# Altium schematic sheet BMS Carrier - AFE Interface.SchDoc: Interfaces
size Tabloid; Author: Liam Sky, Annika Logarta; Revision: 1.0; SheetNumber: 2; SheetTotal: 4; Website: www.uwmidsun.com
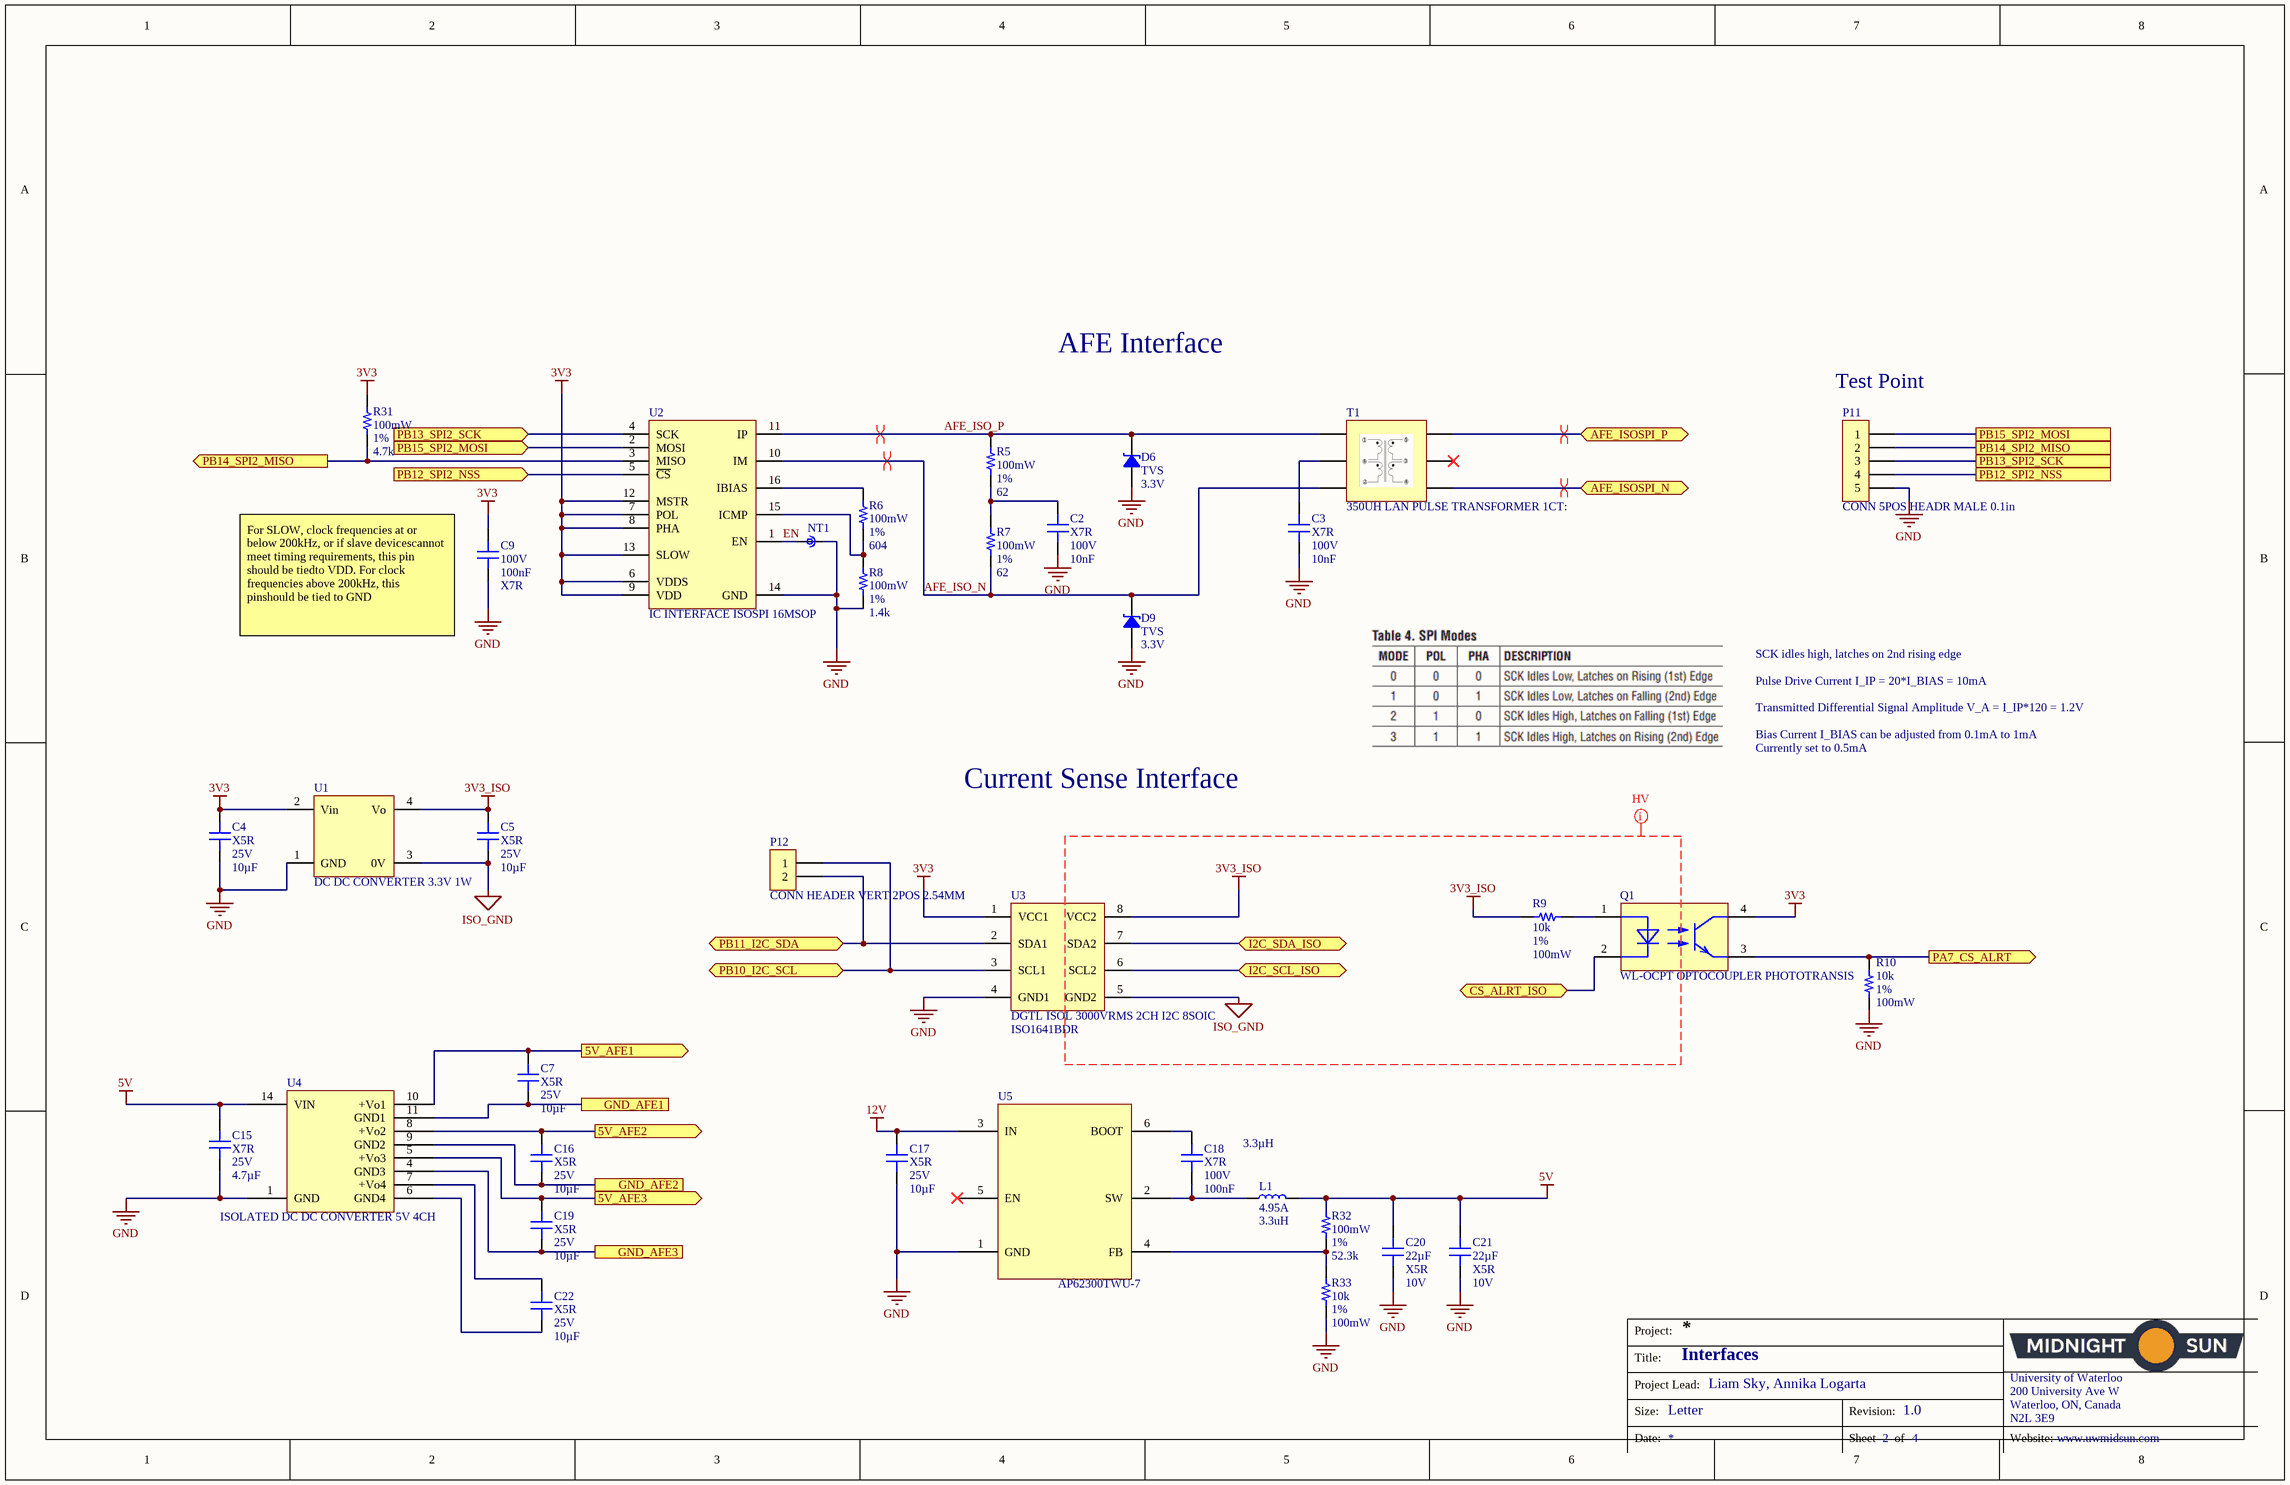
[diagram p0: BMS Carrier - AFE Interface.SchDoc]

## Parts
C2  Dielectric Code: X7R  Voltage Rating: 100V  Capacitance: 10nF  [CAP 0603_1608]  (hidden comment: CAP CER 10NF 100V 10% X7R 0603)
C3  Dielectric Code: X7R  Voltage Rating: 100V  Capacitance: 10nF  [CAP 0603_1608]  (hidden comment: CAP CER 10NF 100V 10% X7R 0603)
C4  Dielectric Code: X5R  Voltage Rating: 25V  Capacitance: 10µF  [CAP 0603_1608]  (hidden comment: CAP CER 10UF 25V 20% X5R 0603)
C5  Dielectric Code: X5R  Voltage Rating: 25V  Capacitance: 10µF  [CAP 0603_1608]  (hidden comment: CAP CER 10UF 25V 20% X5R 0603)
C7  Dielectric Code: X5R  Voltage Rating: 25V  Capacitance: 10µF  [CAP 0603_1608]  (hidden comment: CAP CER 10UF 25V 20% X5R 0603)
C9  Voltage Rating: 100V  Capacitance: 100nF  Dielectric Code: X7R  [CAP 0603_1608]  (hidden comment: CAP CER 0.1UF 100V 10% X7R 0603)
C15  Dielectric Code: X7R  Voltage Rating: 25V  Capacitance: 4.7µF  [CAP 0603_1608]  (hidden comment: CAP CER 4.7UF 25V 10% X5R 0603)
C16  Dielectric Code: X5R  Voltage Rating: 25V  Capacitance: 10µF  [CAP 0603_1608]  (hidden comment: CAP CER 10UF 25V 20% X5R 0603)
C17  Dielectric Code: X5R  Voltage Rating: 25V  Capacitance: 10µF  [CAP 0603_1608]  (hidden comment: CAP CER 10UF 25V 20% X5R 0603)
C18  Dielectric Code: X7R  Voltage Rating: 100V  Capacitance: 100nF  [CAP 0603_1608]  (hidden comment: CAP CER 0.1UF 100V 10% X7R 0603)
C19  Dielectric Code: X5R  Voltage Rating: 25V  Capacitance: 10µF  [CAP 0603_1608]  (hidden comment: CAP CER 10UF 25V 20% X5R 0603)
C20  Capacitance: 22µF  Dielectric Code: X5R  Voltage Rating: 10V  [CAP 0603_1608]  (hidden comment: CAP CER 22UF 10V 20% X5R 0603)
C21  Capacitance: 22µF  Dielectric Code: X5R  Voltage Rating: 10V  [CAP 0603_1608]  (hidden comment: CAP CER 22UF 10V 20% X5R 0603)
C22  Dielectric Code: X5R  Voltage Rating: 25V  Capacitance: 10µF  [CAP 0603_1608]  (hidden comment: CAP CER 10UF 25V 20% X5R 0603)
D6  Type: TVS  Reverse Blocking Voltage: 3.3V  [SOD 323]  (hidden comment: TVS DIODE 3.3VWM 10VC SOD323)
D9  Type: TVS  Reverse Blocking Voltage: 3.3V  [SOD 323]  (hidden comment: TVS DIODE 3.3VWM 10VC SOD323)
L1  value 3.3µH  Rated Current-Max: 4.95A  Inductance-Nom (L): 3.3uH  [INDUCTOR TDK 6x6]  (hidden comment: FIXED IND 3.3UH 4.95A 30MOHM SMD)
NT1  Net Tie 5mil  [Net Tie]  (value not drawn)  (net tie, no BOM)
P11  CONN 5POS HEADR MALE 0.1in  [CONN, 5POS HEADR 0.1"]
P12  CONN HEADER VERT 2POS 2.54MM  [HDR1X2]  (no BOM)
Q1  WL-OCPT OPTOCOUPLER PHOTOTRANSIS  [WL-OCPT_LSOP4]
R5  Power Rating: 100mW  Tolerance: 1%  Resistance: 62  [RES 0603_1608]  (hidden comment: RES 62 OHM 1% 1/10W 0603)
R6  Power Rating: 100mW  Tolerance: 1%  Resistance: 604  [RES 0603_1608]  (hidden comment: RES 604 OHM 1% 1/10W 0603)
R7  Power Rating: 100mW  Tolerance: 1%  Resistance: 62  [RES 0603_1608]  (hidden comment: RES 62 OHM 1% 1/10W 0603)
R8  Power Rating: 100mW  Tolerance: 1%  Resistance: 1.4k  [RES 0603_1608]  (hidden comment: RES 1.4K OHM 1% 1/10W 0603)
R9  Resistance: 10k  Tolerance: 1%  Power Rating: 100mW  [RES 0603_1608]  (hidden comment: RES 10K OHM 1% 1/10W 0603)
R10  Resistance: 10k  Tolerance: 1%  Power Rating: 100mW  [RES 0603_1608]  (hidden comment: RES 10K OHM 1% 1/10W 0603)
R31  Power Rating: 100mW  Tolerance: 1%  Resistance: 4.7k  [RES 0603_1608]  (hidden comment: RES 4.7K OHM 1% 1/10W 0603)
R32  Power Rating: 100mW  Tolerance: 1%  Resistance: 52.3k  [RES 0603_1608]  (hidden comment: RES 52.3K OHM 1% 1/10W 0603)
R33  Resistance: 10k  Tolerance: 1%  Power Rating: 100mW  [RES 0603_1608]  (hidden comment: RES 10K OHM 1% 1/10W 0603)
T1  350UH LAN PULSE TRANSFORMER 1CT:  [TXF453229NF-121-Footprint-1]
U1  DC DC CONVERTER 3.3V 1W  [DCDC ISOLATED 12V 1W-Footprint-1]
U2  IC INTERFACE ISOSPI 16MSOP  [MSOP 16]
U3  DGTL ISOL 3000VRMS 2CH I2C 8SOIC  Manufacturer Part Number: ISO1641BDR  [SOIC 8]
U4  ISOLATED DC DC CONVERTER 5V 4CH  [DIP14]
U5  Manufacturer Part Number: AP62300TWU-7  [TSOT26]  (hidden comment: CMP-031-00049-1)

## Ports
5V_AFE1 (out), 5V_AFE2 (out), 5V_AFE3 (out), AFE_ISOSPI_N (bidir), AFE_ISOSPI_P (bidir), CS_ALRT_ISO (bidir), GND_AFE1, GND_AFE2, GND_AFE3, I2C_SCL_ISO (bidir), I2C_SDA_ISO (bidir), PA7_CS_ALRT (out), PB10_I2C_SCL (bidir), PB11_I2C_SDA (bidir), PB12_SPI2_NSS, PB12_SPI2_NSS (in), PB13_SPI2_SCK, PB13_SPI2_SCK (in), PB14_SPI2_MISO, PB14_SPI2_MISO (out), PB15_SPI2_MOSI, PB15_SPI2_MOSI (in)

## Nets
3V3: C4.2 C9.2 Q1.4(Collector) R31.1 U1.2(Vin) U2.6(VDDS) U2.7(POL) U2.8(PHA) U2.9(VDD) U2.12(MSTR) U2.13(SLOW) U3.1(VCC1)
3V3_ISO: C5.2 R9.2 U1.4(Vo) U3.8(VCC2)
5V: C15.1 C20.2 C21.2 L1.2 R32.2 U4.14(VIN)
12V: C17.2 U5.3(IN)
GND: C2.1 C3.1 C4.1 C9.1 C15.2 C17.1 C20.1 C21.1 D6.2 D9.2 NT1.2 P11.5 R8.1 R10.1 R33.1 U1.1(GND) U2.14(GND) U3.4(GND1) U4.1(GND) U5.1(GND)
ISO_GND: C5.1 U1.3(0V) U3.5(GND2)
5V_AFE1: C7.2 U4.10(+Vo1) ; port 5V_AFE1
5V_AFE2: C16.2 U4.8(+Vo2) ; port 5V_AFE2
5V_AFE3: C19.2 U4.5(+Vo3) ; port 5V_AFE3
AFE_ISO_N: D9.1 R7.1 T1.2 U2.10(IM)
AFE_ISO_P: D6.1 R5.2 T1.1 U2.11(IP)
AFE_ISOSPI_N: T1.4 ; port AFE_ISOSPI_N
AFE_ISOSPI_P: T1.5 ; port AFE_ISOSPI_P
CS_ALRT_ISO: Q1.2(Cathode) ; port CS_ALRT_ISO
EN: NT1.1 U2.1(EN)
GND_AFE1: C7.1 U4.11(GND1) ; port GND_AFE1
GND_AFE2: C16.1 U4.9(GND2) ; port GND_AFE2
GND_AFE3: C19.1 U4.4(GND3) ; port GND_AFE3
I2C_SCL_ISO: U3.6(SCL2) ; port I2C_SCL_ISO
I2C_SDA_ISO: U3.7(SDA2) ; port I2C_SDA_ISO
PA7_CS_ALRT: Q1.3(Emitter) R10.2 ; port PA7_CS_ALRT
PB10_I2C_SCL: P12.1 U3.3(SCL1) ; port PB10_I2C_SCL
PB11_I2C_SDA: P12.2 U3.2(SDA1) ; port PB11_I2C_SDA
PB12_SPI2_NSS: P11.4 U2.5(~{CS}) ; port PB12_SPI2_NSS
PB13_SPI2_SCK: P11.3 U2.4(SCK) ; port PB13_SPI2_SCK
PB14_SPI2_MISO: P11.2 R31.2 U2.3(MISO) ; port PB14_SPI2_MISO
PB15_SPI2_MOSI: P11.1 U2.2(MOSI) ; port PB15_SPI2_MOSI
NetC2_2: C2.2 R5.1 R7.2
NetC3_2: C3.2 T1.6
NetC18_1: C18.1 L1.1 U5.2(SW)
NetC18_2: C18.2 U5.6(BOOT)
NetC22_1: C22.1 U4.6(GND4)
NetC22_2: C22.2 U4.7(+Vo4)
NetQ1_1: Q1.1(Anode) R9.1
NetR6_1: R6.1 R8.2 U2.15(ICMP)
NetR6_2: R6.2 U2.16(IBIAS)
NetR32_1: R32.1 R33.2 U5.4(FB)

Not connected (* = marked no-connect by the designer): T1 3(1)*; U5 5(EN)*

## Layout directives
differential pair: AFE_ISO_N, AFE_ISO_P, AFE_ISOSPI_N, AFE_ISOSPI_P
mark named HV: 3V3_ISO, ISO_GND

## Notes on the sheet
- AFE Interface
- (near P11) Test Point
- (near C9) For SLOW, clock frequencies at or below 200kHz, or if slave devicescannot meet timing requirements, this pin should be tiedto VDD. For clock frequencies above 200kHz, this pinshould be tied to GND
- Pulse Drive Current I_IP = 20*I_BIAS = 10mA
- SCK idles high, latches on 2nd rising edge
- Bias Current I_BIAS can be adjusted from 0.1mA to 1mA
- Currently set to 0.5mA
- Transmitted Differential Signal Amplitude V_A = I_IP*120 = 1.2V
- Current Sense Interface
- Project:
- Title:
- Size:
- Project Lead:
- Letter
- Revision:
- University of Waterloo
- 200 University Ave W
- Waterloo, ON, Canada
- N2L 3E9
- Date:
- Sheet
- of
- Website:

## Library data of the parts
C2 C3 = CMP-001-00137-3: Ceramic Capacitor, Multilayer, Ceramic, 100V, 10% +Tol, 10% -Tol, X7R, 15% TC, 0.01uF, Surface Mount, 0603; Tolerance: 10%; Case/Package: 0603
C4 C5 C7 C16 C17 C19 C22 = CMP-013-0018-6: 10µF ±20% 25V Ceramic Capacitor X5R 0603 (1608 Metric); Case/Package: 0603; Tolerance: 20%
C9 C18 = CMP-013-0022-14: Ceramic Capacitor, Multilayer, Ceramic, 100V, 10% +Tol, 10% -Tol, X7R, 15% TC, 0.1uF, Surface Mount, 0603; Tolerance: 10%; Case/Package: 0603
C15 = CMP-013-0104-5: 4.7µF ±10% 25V Ceramic Capacitor X5R 0603 (1608 Metric); Case/Package: 0603; Tolerance: 10%
C20 C21 = CMP-013-0021-7: Ceramic Capacitor, Multilayer, Ceramic, 10V, 20% +Tol, 20% -Tol, X5R, 15% TC, 22uF, Surface Mount, 0603; Tolerance: 20%; Case/Package: 0603
D6 D9 = CMP-004-00065-3: Trans Voltage Suppressor Diode, 3.3V V(RWM), Unidirectional, 1 Element, Silicon; Breakdown Voltage: 6V; Case/Package: SOD-323
L1 = CMP-006-00030-2: General Purpose Inductor, 3.3uH, 30%, 1 Element, Ferrite-Core, SMD, 2424; Self Resonant Frequency: 0Hz; Shielding: Shielded; Package Height: 4.5mm; Inductor Application: POWER INDUCTOR; Package Length: 6mm; Shape/Size Description: RECTANGULAR PACKAGE; DC Resistance (DCR): 23mR; Number of Functions: 1; Test Frequency: 100kHz; Max Operating Temperature: 105°C; Source: Local.SchLib; Case/Package: Nonstandard; RoHS Compliant: Yes; Packaging: Tape and Reel; Package Style: SMTMeter; REACH SVHC: Yes; Pins: 2; Design Item ID: FIXED IND 3.3UH 4.95A 30MOHM SMD; Inductor Type: GENERAL PURPOSE INDUCTOR; RoHS: Yes; Surface Mount: Yes; Pricing 1: 1=0.51000, 10=0.44300, 25=0.41120, 50=0.34780, 100=0.31620, 250=0.29728, 500=0.26564 (USD); Stock 1: 128298; Termination: One Surface; Terminal Placement: Dual Ended; Tolerance: 30%; Package Width: 6mm; Min Operating Temperature: -40°C
NT1 = CMP-009-00116-5: Case/Package: Net Tie
P11 = CMP-007-0050-1: 5 Positions Header, Breakaway Connector 0.100" (2.54mm) Through Hole Tin; Manufacturer Part Number 1: 0022284050; Manufacturer 1: Molex; Max Voltage Rating (DC): 250V; Description 1: Conn Unshrouded Header HDR 5 POS 2.54mm Solder ST Thru-Hole KK® Bag; Connector Type: Male Pin; Number of Contacts: 5; Contact Resistance: 20mR; ComponentLink1URL: https://datasheet.ciiva.com/6814/022284363-sd-6814049.pdf; Housing Colour: Black; Colour: Black; ComponentLink3Description: https://datasheet.ciiva.com/15217/getdatasheetpartid-256138-15217709.pdf; Depth: 2.49mm; Length: 12.7mm; Contact Plating: Nickel,Tin; ComponentLink2Description: https://datasheet.ciiva.com/14804/179390022284050-pcb-headers-14804361.pdf; Contact Material: Bronze,Brass; Housing Material: Nylon; Min Operating Temperature: 0°C; Pitch: 2.54mm; Contact Mating Length: 0.24inch; Pricing 1: 1=0.22, 10=0.21, 25=0.1796, 50=0.157, 100=0.1459, 250=0.129, 500=0.1234 (USD); Orientation: Straight; Source: Schematic Diagrams.SchLib; Gender: Male; Number of Rows: 1; ComponentLink2URL: https://datasheet.ciiva.com/14804/179390022284050-pcb-headers-14804361.pdf; Number of Positions: 5; ComponentLink3URL: https://datasheet.ciiva.com/15217/getdatasheetpartid-256138-15217709.pdf; ComponentLink1Description: https://datasheet.ciiva.com/6814/022284363-sd-6814049.pdf; Termination: Solder; Packaging: Bulk; Mount: Through Hole; Max Voltage Rating (AC): 250V; Stock 1: 3161; Max Operating Temperature: 75°C; Design Item ID: CONN 5POS HEADR MALE 0.1in
P12 = CMP-002-00166-3: Connector Header Through Hole 2 position 0.100" (2.54mm); Pins: 2
Q1 = CMP-00026-00001-1: Optocoupler, Transistor, 80V, Lsop-4 Rohs Compliant: Yes; RoHS Compliant: Yes
R5 R7 = CMP-010-0025-8: Fixed Resistor, Metal Glaze/thick Film, 0.1W, 62ohm, 75V, 1% +/-Tol, 100ppm/Cel, Surface Mount, 0603; Temperature Coefficient: 100ppm/°C; Voltage Rating: 75V; Case/Package: 0603
R6 = CMP-00038-1: Fixed Resistor, Metal Glaze/thick Film, 0.1W, 604ohm, 75V, 1% +/-Tol, 100ppm/Cel, Surface Mount, 0603; Temperature Coefficient: 100ppm/°C; Case/Package: 0603; Voltage Rating: 75V
R8 = CMP-00039-1: Fixed Resistor, Metal Glaze/thick Film, 0.1W, 1400ohm, 75V, 1% +/-Tol, 100ppm/Cel, Surface Mount, 0603; Temperature Coefficient: 100ppm/°C; Case/Package: 0603; Voltage Rating: 75V
R9 R10 R33 = CMP-009-00190-14: 10 ±1% 0.1W, 1/10W Chip Resistor 0603 (1608 Metric) Automotive AEC-Q200 Thick Film; Voltage Rating: 75V; Temperature Coefficient: 100ppm/°C; Case/Package: 0603
R31 = CMP-010-0075-8: Fixed Resistor, Metal Glaze/thick Film, 0.1W, 4700ohm, 75V, 1% +/-Tol, 100ppm/Cel, Surface Mount, 0603; Temperature Coefficient: 100ppm/°C; Case/Package: 0603; Voltage Rating: 75V
R32 = CMP-00010-4: Fixed Resistor, Metal Glaze/thick Film, 0.1W, 52300ohm, 75V, 1% +/-Tol, 100ppm/Cel, Surface Mount, 0603; Temperature Coefficient: 100ppm/°C; Case/Package: 0603; Voltage Rating: 75V
T1 = CMP-012-00000-2: 350µH LAN Pulse Transformer 1:1 Surface Mount
U1 = CMP-019-00064-2: Max Supply Voltage: 3.6V; Min Supply Voltage: 3V; Output Voltage: 3.3V
U2 = CMP-015-00019-2: Isolated Communications Interface 3.3V/5V Automotive 16-Pin MSOP Tube; Manufacturer Part Number: LTC6820IMS#PBF; Min Supply Voltage: 2.7V; Max Supply Voltage: 5.5V; Case/Package: MSOP 16
U3 = CMP-015-00024-2: I²C Digital Isolator 3000Vrms 2 Channel 1Mbps 50kV/µs CMTI 8-SOIC (0.154", 3.90mm Width); Min Supply Voltage: 3V; Max Supply Voltage: 5.5V; Case/Package: SOIC 8
U4 = CMP-015-00027-4: Isolated Module DC DC Converter 4 Output 5V 5V 5V 5V 50mA, 50mA, 50mA, 50mA 4.5V - 5.5V Input; Min Supply Voltage: 4.5V; Max Supply Voltage: 5.5V; Case/Package: Tube
U5 = CMP-031-00049-1: Buck Switching Regulator IC Positive Adjustable 0.8V 1 Output 3A SOT-23-6 Thin, TSOT-23-6; Manufacturer: Diodes; RoHS: Yes; Category: Voltage Regulators - Switching; Stock 1: 275295; Pricing 1: 1=0.53000, 10=0.42900, 25=0.39280, 100=0.29240, 250=0.26496, 500=0.21930, 1000=0.16447 (USD); Design Item ID: IC REG BUCK ADJ 3A TSOT26; Source: Local.SchLib